# EAGLE design ESP32 (EAGLE 9.6.1)
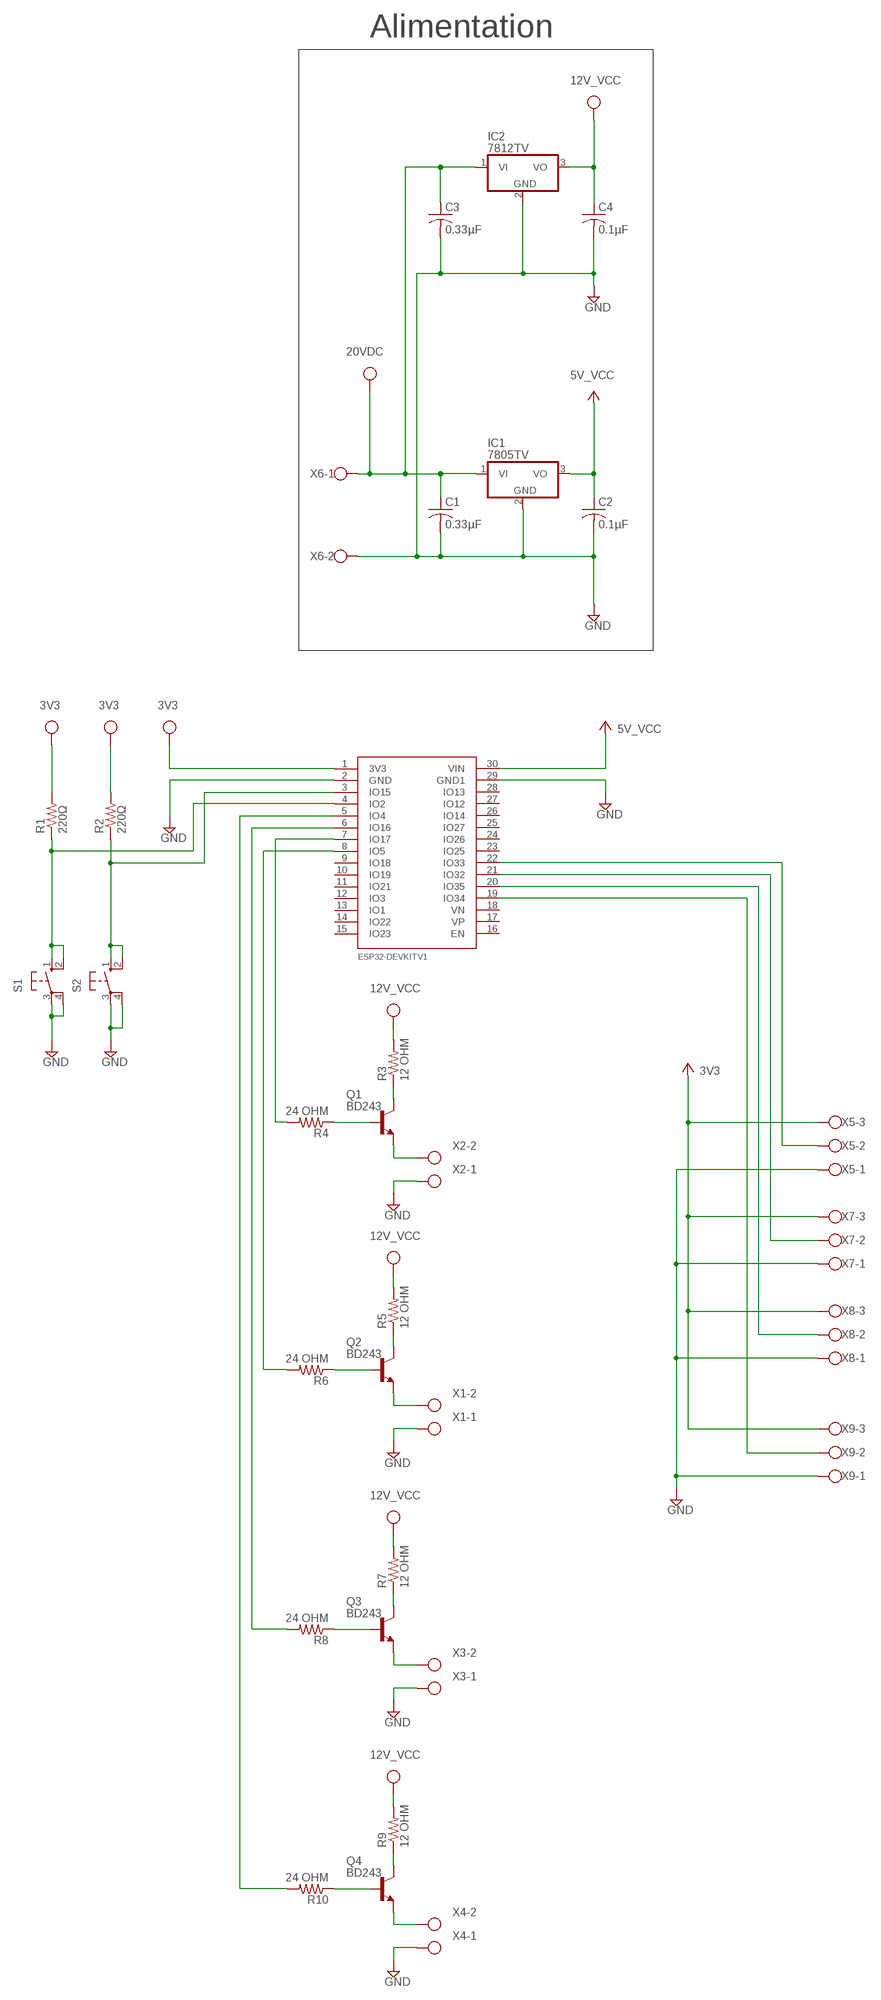
[diagram p0: schematic, sheet 1]

## Parts
C1  0.33µF  C-USC0805  [C0805]
C2  0.1µF  C-USC0805  [C0805]
C3  0.33µF  C-USC0805  [C0805]
C4  0.1µF  C-USC0805  [C0805]
IC1  7805TV  [TO220V]
IC2  7812TV  [TO220V]
Q1  BD243  [TO220]
Q2  BD243  [TO220]
Q3  BD243  [TO220]
Q4  BD243  [TO220]
R1  220Ω  R-US_0204/5  [0204/5]
R2  220Ω  R-US_0204/5  [0204/5]
R3  12 OHM  R-US_0204/7  [0204/7]
R4  24 OHM  R-US_0204/7  [0204/7]
R5  12 OHM  R-US_0204/7  [0204/7]
R6  24 OHM  R-US_0204/7  [0204/7]
R7  12 OHM  R-US_0204/7  [0204/7]
R8  24 OHM  R-US_0204/7  [0204/7]
R9  12 OHM  R-US_0204/7  [0204/7]
R10  24 OHM  R-US_0204/7  [0204/7]
S1  10-XX  [B3F-10XX]
S2  10-XX  [B3F-10XX]
U$1  ESP32DEVKITV1  [ESP32-DEVKITV1]
X1  W237-102  [W237-102]
X2  W237-102  [W237-102]
X3  W237-102  [W237-102]
X4  W237-102  [W237-102]
X5  W237-103  [W237-103]
X6  W237-102  [W237-102]
X7  W237-103  [W237-103]
X8  W237-103  [W237-103]
X9  W237-103  [W237-103]

## Nets
3V3: R1.2 R2.2 U$1.1(3V3) X5.3 X7.3 X8.3 X9.3 ; supply symbol labelled VCC
5V_VCC: C2.1 IC1.3(VO) U$1.30(VIN) ; supply symbol labelled VCC
12V_VCC: C4.1 IC2.3(VO) R3.2 R5.2 R7.2 R9.2 ; supply symbol labelled VCC
20VDC: C1.1 C3.1 IC1.1(VI) IC2.1(VI) X6.1 ; supply symbol labelled VCC
GND: C1.2 C2.2 C3.2 C4.2 IC1.2(GND) IC2.2(GND) S1.3(P) S1.4(P1) S2.3(P) S2.4(P1) U$1.2(GND) U$1.29(GND1) X1.1 X2.1 X3.1 X4.1 X5.1 X6.2 X7.1 X8.1 X9.1
N$1: R1.1 S1.1(S) S1.2(S1) U$1.4(IO2)
N$2: Q1.3(E) X2.2
N$3: R2.1 S2.1(S) S2.2(S1) U$1.3(IO15)
N$4: Q1.2(C) R3.1
N$5: Q1.1(B) R4.1
N$6: Q2.3(E) X1.2
N$7: Q2.2(C) R5.1
N$8: Q2.1(B) R6.1
N$9: Q3.3(E) X3.2
N$10: Q3.2(C) R7.1
N$11: Q3.1(B) R8.1
N$12: Q4.3(E) X4.2
N$13: Q4.2(C) R9.1
N$14: Q4.1(B) R10.1
N$15: R4.2 U$1.7(IO17)
N$16: U$1.22(IO33) X5.2
N$17: R8.2 U$1.6(IO16)
N$18: R6.2 U$1.8(IO5)
N$19: R10.2 U$1.5(IO4)
N$20: U$1.21(IO32) X7.2
N$21: U$1.20(IO35) X8.2
N$22: U$1.19(IO34) X9.2
Unconnected: U$1.9(IO18) U$1.10(IO19) U$1.11(IO21) U$1.12(IO3) U$1.13(IO1) U$1.14(IO22) U$1.15(IO23) U$1.16(EN) U$1.17(VP) U$1.18(VN) U$1.23(IO25) U$1.24(IO26) U$1.25(IO27) U$1.26(IO14) U$1.27(IO12) U$1.28(IO13)

## Notes on the sheet
- Alimentation

## Library data of the parts
C1-C4 = rcl:C-US: CAPACITOR, American symbol; SPICEPREFIX: C
IC1 IC2 = linear:78*: Positive VOLTAGE REGULATOR Source: http://cache.national.com/ds/LM/LM78L05.pdf http://www.fairchildsemi.com/ds/LM/LM7805.pdf
Q1-Q4 = transistor-npn:BD243*: NPN Transistor
R1-R10 = rcl:R-US_: RESISTOR, American symbol; SPICEPREFIX: R
S1 S2 = switch-omron:10-XX: OMRON SWITCH; MPN: B3F-1000; OC_FARNELL: 176432; OC_NEWARK: 36M3542
U$1 = ESP32-DEVKITV1:ESP32DEVKITV1
X1-X4 X6 = con-wago-500:W237-102: WAGO SCREW CLAMP; MPN: 237-102; OC_FARNELL: unknown; OC_NEWARK: 70K9898
X5 X7-X9 = con-wago-500:W237-103: WAGO SCREW CLAMP; MPN: 237-103; OC_FARNELL: unknown; OC_NEWARK: 18M7116

## Board
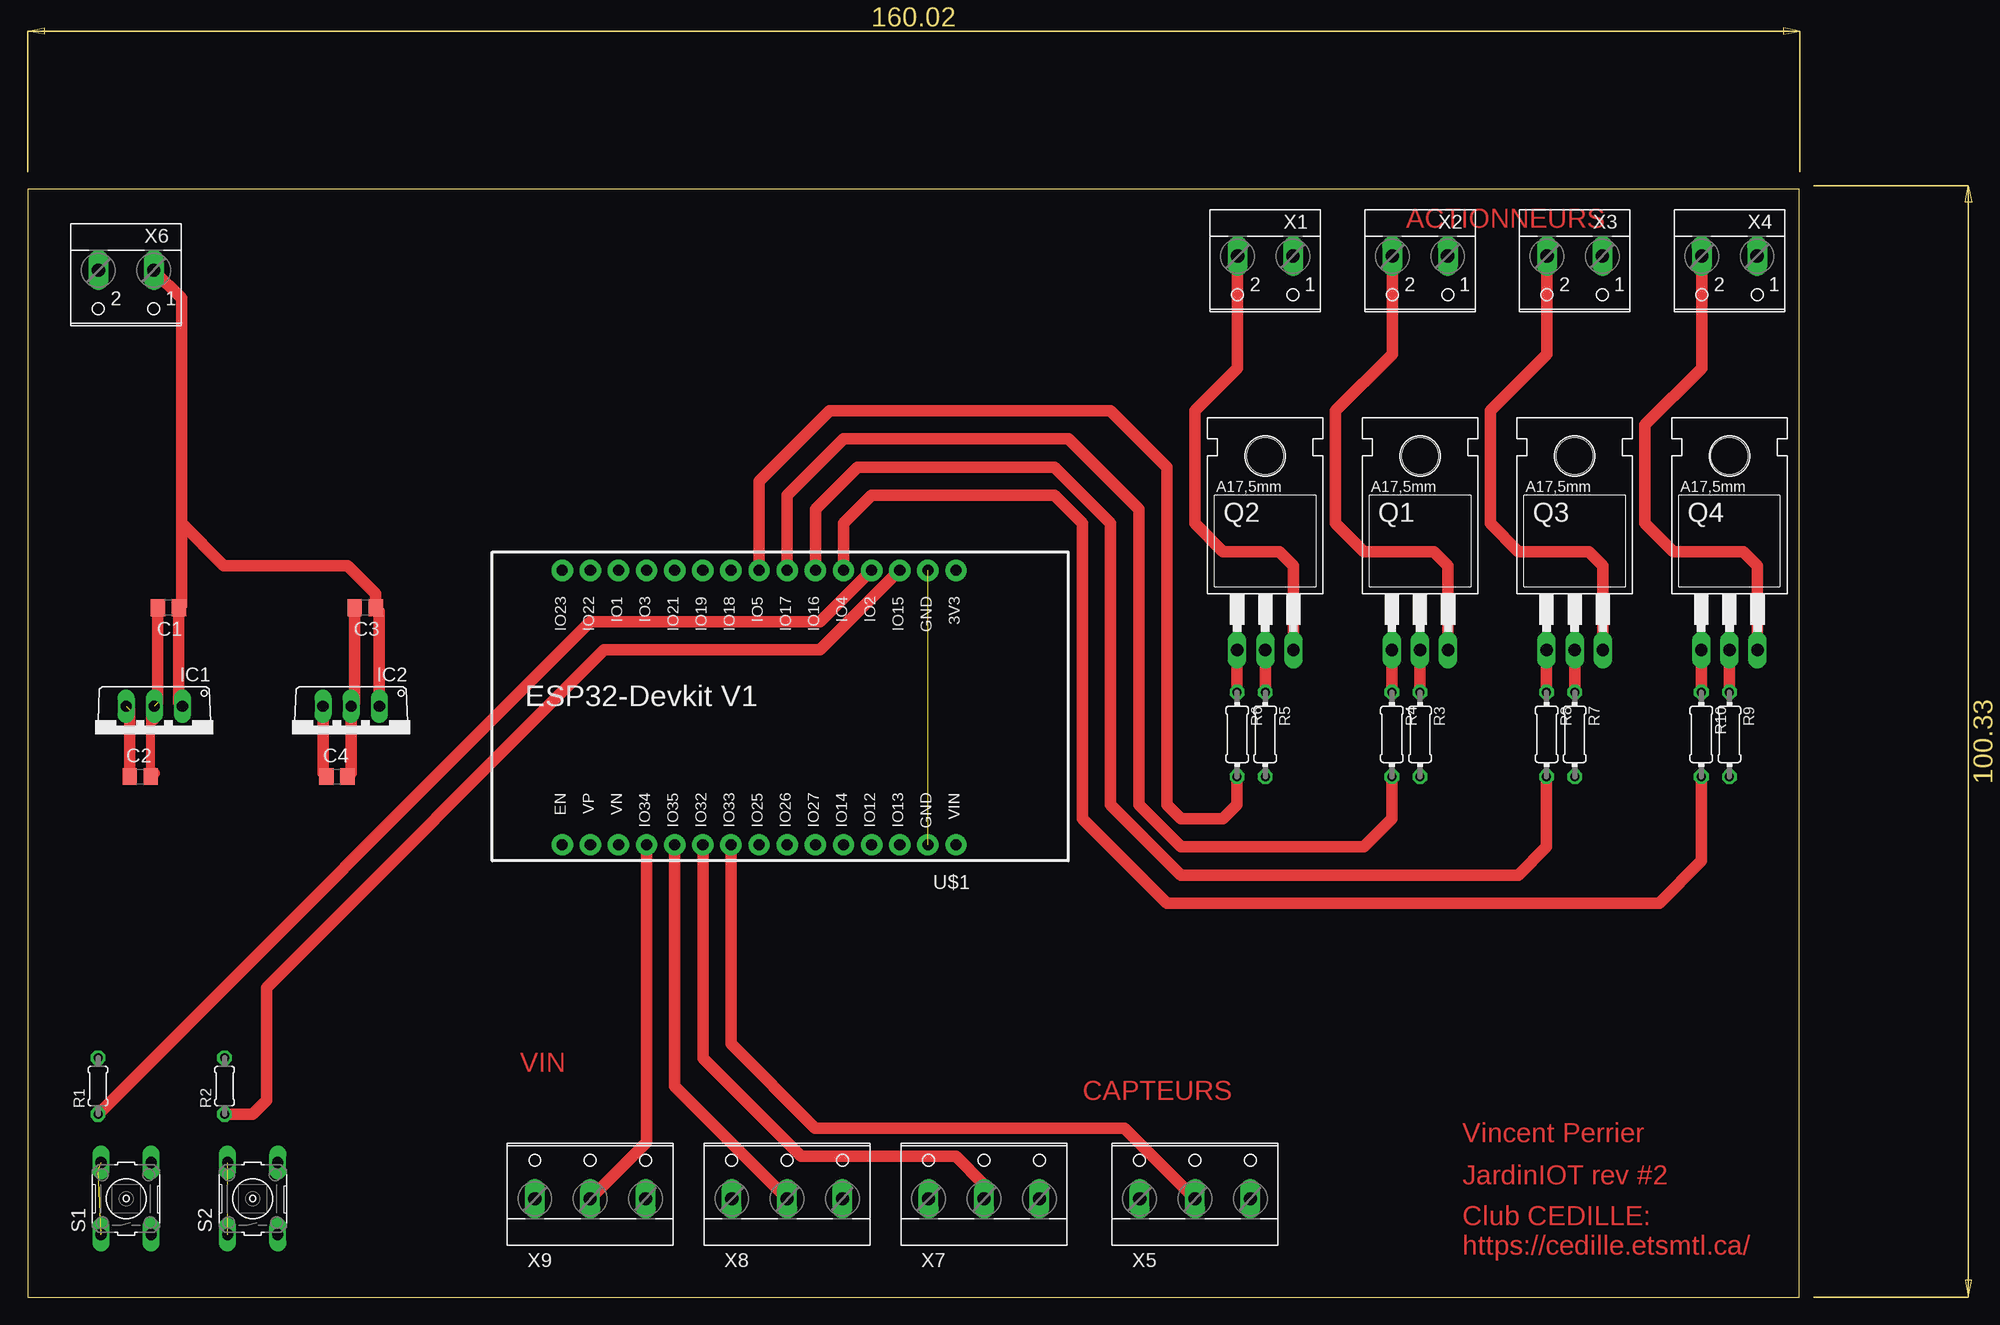
[diagram p1: board, top side]
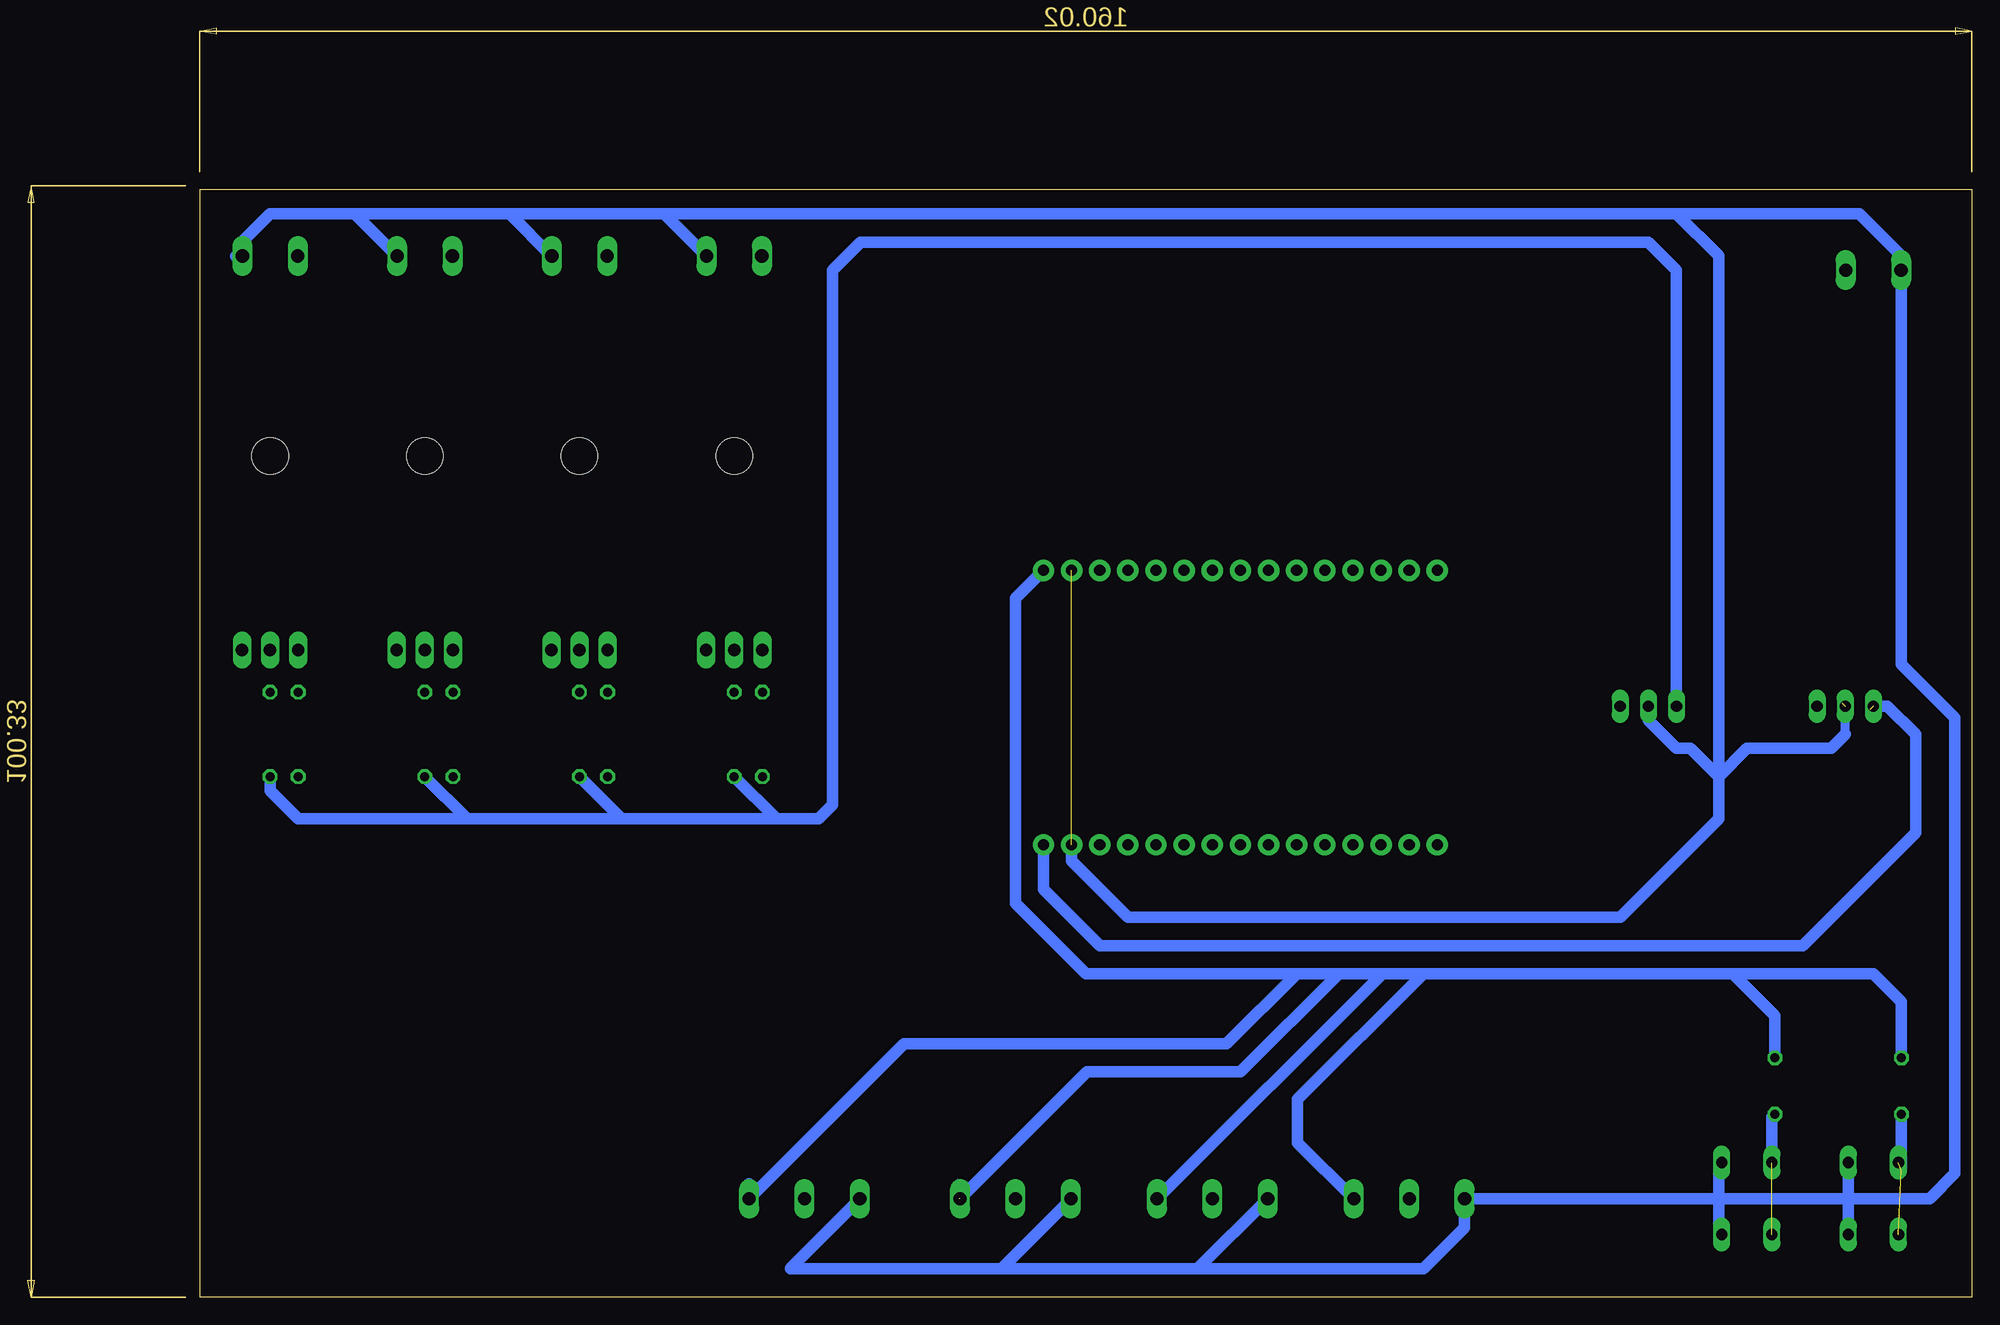
[diagram p2: board, bottom side, seen from below]

Size 160 x 100 mm. Coordinates in mm from the lower left corner, seen from the top.
Outline: 0,0 160,0 160,100 0,100 0,0
Copper layers (1*16): Top 0.035mm / dielectric 1.5mm / Bottom 0.035mm
Design rules "default": minimum track width 6mil, minimum drill 0.35mm, track to track 6mil, track to pad 6mil, pad to pad 6mil, via to via 6mil, smd to smd 6mil, copper to edge 40mil, drill to drill 6mil, minimum pad ring 10mil, minimum via ring 8mil, stop-mask expansion 4mil, vias tented up to drill 0mil, thermal gap 10mil

### Footprints (pad centres in the part's own frame; a part is rotated, then mirrored left to right if it is on the bottom)
C0805 = smd 1.3 x 1.5: 1 -0.95,0; 2 0.95,0
TO220V = drill 1.016 long: 1 -2.54,-2.54; 2 0,-2.54; 3 2.54,-2.54
TO220 = drill 1.118 long: 1 -2.54,-6.35; 2 0,-6.35; 3 2.54,-6.35 | hole 3.302: 0,11.176
0204/5 = drill 0.813 octagon: 1 -2.54,0; 2 2.54,0
0204/7 = drill 0.813 octagon: 1 -3.81,0; 2 3.81,0
B3F-10XX = drill 1.016 long: 1 -3.251,2.261; 2 3.251,2.261; 3 -3.251,-2.261; 4 3.251,-2.261
ESP32-DEVKITV1 = drill 1 pad 1.93: 1 -22.87,-13.54; 2 -20.33,-13.54; 3 -17.79,-13.54; 4 -15.25,-13.54; 5 -12.71,-13.54; 6 -10.17,-13.54; 7 -7.63,-13.54; 8 -5.09,-13.54; 9 -2.55,-13.54; 10 -0.01,-13.54; 11 2.53,-13.54; 12 5.07,-13.54; 13 7.61,-13.54; 14 10.15,-13.54; 15 12.69,-13.54; 16 12.69,11.23; 17 10.15,11.23; 18 7.61,11.23; 19 5.07,11.23; 20 2.53,11.23; 21 -0.01,11.23; 22 -2.55,11.23; 23 -5.09,11.23; 24 -7.63,11.23; 25 -10.17,11.23; 26 -12.71,11.23; 27 -15.25,11.23; 28 -17.79,11.23; 29 -20.33,11.23; 30 -22.87,11.23
W237-102 = drill 1.194 long: 1 -2.5,-1.27; 2 2.5,-1.27
W237-103 = drill 1.194 long: 1 -5,-1.29; 2 0,-1.29; 3 5,-1.29

### Placement (x,y rotation side)
C1  12.7,62.23 180 top
C2  10.16,46.99 0 top
C3  30.48,62.23 180 top
C4  27.94,46.99 0 top
IC1  11.43,50.8 180 top
IC2  29.21,50.8 180 top
Q1  125.73,64.77 0 top
Q2  111.76,64.77 0 top
Q3  139.7,64.77 0 top
Q4  153.67,64.77 0 top
R1  6.35,19.05 90 top
R2  17.78,19.05 90 top
R3  125.73,50.8 270 top
R4  123.19,50.8 270 top
R5  111.76,50.8 270 top
R6  109.22,50.8 270 top
R7  139.7,50.8 270 top
R8  137.16,50.8 270 top
R9  153.67,50.8 270 top
R10  151.13,50.8 270 top
S1  8.89,8.89 90 top
S2  20.32,8.89 90 top
U$1  60.96,52.07 180 top
X1  111.76,92.71 180 top
X2  125.73,92.71 180 top
X3  139.7,92.71 180 top
X4  153.67,92.71 180 top
X5  105.41,10.16 0 top
X6  8.89,91.44 180 top
X7  86.36,10.16 0 top
X8  68.58,10.16 0 top
X9  50.8,10.16 0 top

### Tracks (layer width: path | path; a pad name or v marks a point on that pad's centre or on a via)
3V3  (1 unrouted)
  Bottom 1.016: 91.44,10.16 91.44,8.89 | 110.41,10.24 X5.3 96.42,22.86 67.31,22.86 60.96,29.21 | U$1.1 86.36,63.08 86.36,35.56 80.01,29.21 60.96,29.21 | 60.96,29.21 57.15,29.21 | 57.15,29.21 53.24,29.21 | 53.24,29.21 49.53,29.21 | 49.53,29.21 21.59,29.21 | 21.59,29.21 17.78,25.4 R2.2 | 21.59,29.21 8.89,29.21 6.35,26.67 R1.2 | X7.3 79.91,20.32 66.04,20.32 57.15,29.21 | X8.3 53.24,29.21 | X9.3 60.88,13.95 60.88,17.86 49.53,29.21
5V_VCC  (1 unrouted)
  Top 1.016: 9.21,53.02 C2.1
  Bottom 1.016: IC1.3 7.62,53.34 5.08,50.8 5.08,41.91 15.25,31.74 78.73,31.74 83.83,36.84 U$1.30
12V_VCC
  Top 1.016: C4.1 26.67,47.31 IC2.3
  Bottom 1.016: IC2.3 26.67,92.71 29.21,95.25 100.33,95.25 102.87,92.71 102.87,44.45 104.14,43.18 107.95,43.18 | 107.95,43.18 121.92,43.18 | 121.92,43.18 135.89,43.18 | 135.89,43.18 151.13,43.18 153.67,45.72 R9.2 | R7.2 135.89,43.18 | R3.2 121.92,43.18 | R5.2 107.95,43.18
20VDC
  Top 0.813: IC1.1 13.65,53.34 13.65,54.61
  Top 1.016: X6.1 11.39,92.67 13.89,90.17 13.89,69.85 | 13.89,69.85 13.89,62.47 C1.1 13.65,54.61 13.65,53.66 | IC2.1 31.75,61.91 C3.1 31.43,63.5 28.89,66.04 17.7,66.04 13.89,69.85
GND  (2 unrouted)
  Top 0.813: 11.43,52.07 IC1.2 11.11,53.34 C2.2
  Top 1.016: 6.43,92.67 X6.2 | C1.2 11.75,53.66 | C3.2 29.53,53.66 IC2.2 29.21,47.31 C4.2 | 11.43,47.31 C2.2
  Bottom 0.813: 11.43,50.8 IC1.2
  Bottom 1.016: 156.79,93.98 X4.1 156.17,95.29 153.65,97.81 146.03,97.81 | X2.1 132.06,97.81 | X1.1 118.09,97.81 | 118.09,97.81 132.06,97.81 | 118.09,97.81 26.67,97.81 | 26.67,97.81 10.18,97.81 6.39,94.02 X6.2 6.39,57.15 1.52,52.28 1.52,11.18 3.81,8.89 11.15,8.89 | 132.06,97.81 146.03,97.81 | X3.1 146.03,97.81 | S1.4 11.15,8.89 | S1.3 11.15,8.89 | 11.15,8.89 22.86,8.89 | 22.86,8.89 22.86,11.86 S2.4 | 22.86,8.89 22.86,5.92 S2.3 | 26.67,97.81 22.86,94 22.86,46.99 | 22.86,46.99 22.86,43.18 31.76,34.28 76.19,34.28 81.29,39.38 U$1.29 | IC2.2 29.21,52.07 26.67,49.53 25.4,49.53 22.86,46.99 | 11.43,50.8 12.7,49.53 20.32,49.53 22.86,46.99 | 22.86,8.89 45.78,8.89 X9.1 45.8,6.27 49.53,2.54 69.91,2.54 | 69.91,2.54 87.63,2.54 | 87.63,2.54 106.68,2.54 106.68,2.6 X5.1 | X7.1 81.36,8.81 87.63,2.54 | X8.1 69.91,2.54
N$1  (2 unrouted)
  Top 1.016: R1.1 50.8,60.96 71.56,60.96 U$1.4
  Bottom 1.016: R1.1 6.35,11.43
N$2
  Top 1.016: Q1.3 128.27,66.04 127,67.31 120.65,67.31 118.11,69.85 118.11,80.01 123.23,85.13 X2.2
N$3  (1 unrouted)
  Top 1.016: U$1.3 71.56,58.42 52.07,58.42 21.59,27.94 21.59,17.78 20.32,16.51 R2.1
  Bottom 1.016: R2.1 18.06,16.23 S2.2
N$4
  Top 1.016: Q1.2 R3.1
N$5
  Top 1.016: Q1.1 R4.1
N$6
  Top 1.016: X1.2 109.26,83.86 105.41,80.01 105.41,69.85 107.95,67.31 113.03,67.31 114.3,66.04 Q2.3
N$7
  Top 1.016: Q2.2 R5.1
N$8
  Top 1.016: Q2.1 R6.1
N$9
  Top 1.016: Q3.3 142.24,66.04 140.97,67.31 134.62,67.31 132.08,69.85 132.08,80.01 137.2,85.13 X3.2
N$10
  Top 1.016: Q3.2 R7.1
N$11
  Top 1.016: Q3.1 R8.1
N$12
  Top 1.016: Q4.3 156.21,66.04 154.94,67.31 148.59,67.31 146.05,69.85 146.05,78.74 151.17,83.86 X4.2
N$13
  Top 1.016: Q4.2 R9.1
N$14
  Top 1.016: Q4.1 R10.1
N$15
  Top 1.016: R4.2 123.19,43.18 120.65,40.64 104.14,40.64 100.33,44.45 100.33,71.12 93.98,77.47 73.66,77.47 68.58,72.39 U$1.7
N$16
  Top 1.016: X5.2 99.04,15.24 71.12,15.24 63.51,22.85 U$1.22
N$17
  Top 1.016: U$1.6 71.13,71.13 74.93,74.93 92.71,74.93 97.79,69.85 97.79,44.45 104.14,38.1 134.62,38.1 137.16,40.64 R8.2
N$18
  Top 1.016: U$1.8 66.05,73.67 72.39,80.01 97.79,80.01 102.87,74.93 102.87,44.45 104.14,43.18 107.95,43.18 109.22,44.45 R6.2
N$19
  Top 1.016: U$1.5 73.67,69.86 76.2,72.39 92.71,72.39 95.25,69.85 95.25,43.18 102.87,35.56 147.32,35.56 151.13,39.37 R10.2
N$20
  Top 1.016: U$1.21 60.97,21.58 69.85,12.7 83.82,12.7 86.36,10.16 X7.2
N$21
  Top 1.016: 68.58,10.16 X8.2 58.43,19.02 U$1.20
N$22
  Top 1.016: U$1.19 55.89,13.96 X9.2

### Text on the board
Top: ACTIONNEURS | VIN | CAPTEURS | Vincent Perrier | JardinIOT rev #2 | Club CEDILLE: / https://cedille.etsmtl.ca/